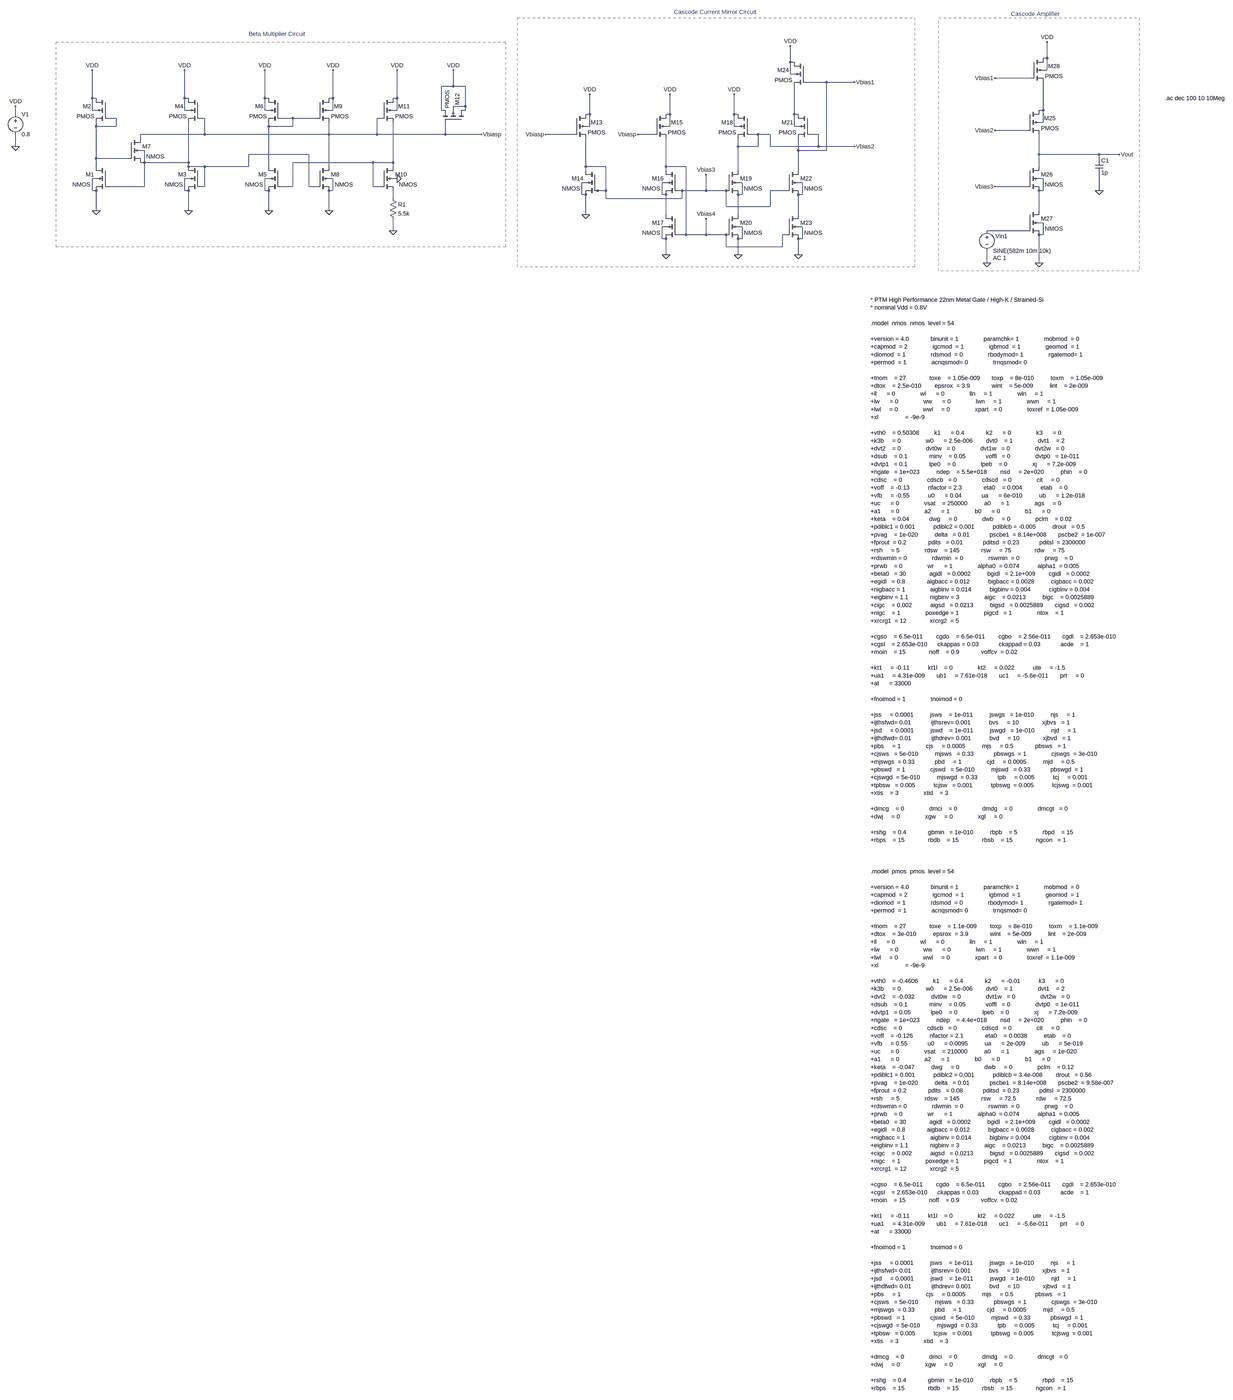
[diagram p0: schematic Rohan Nijhawan_22nm.asc, whole sheet]
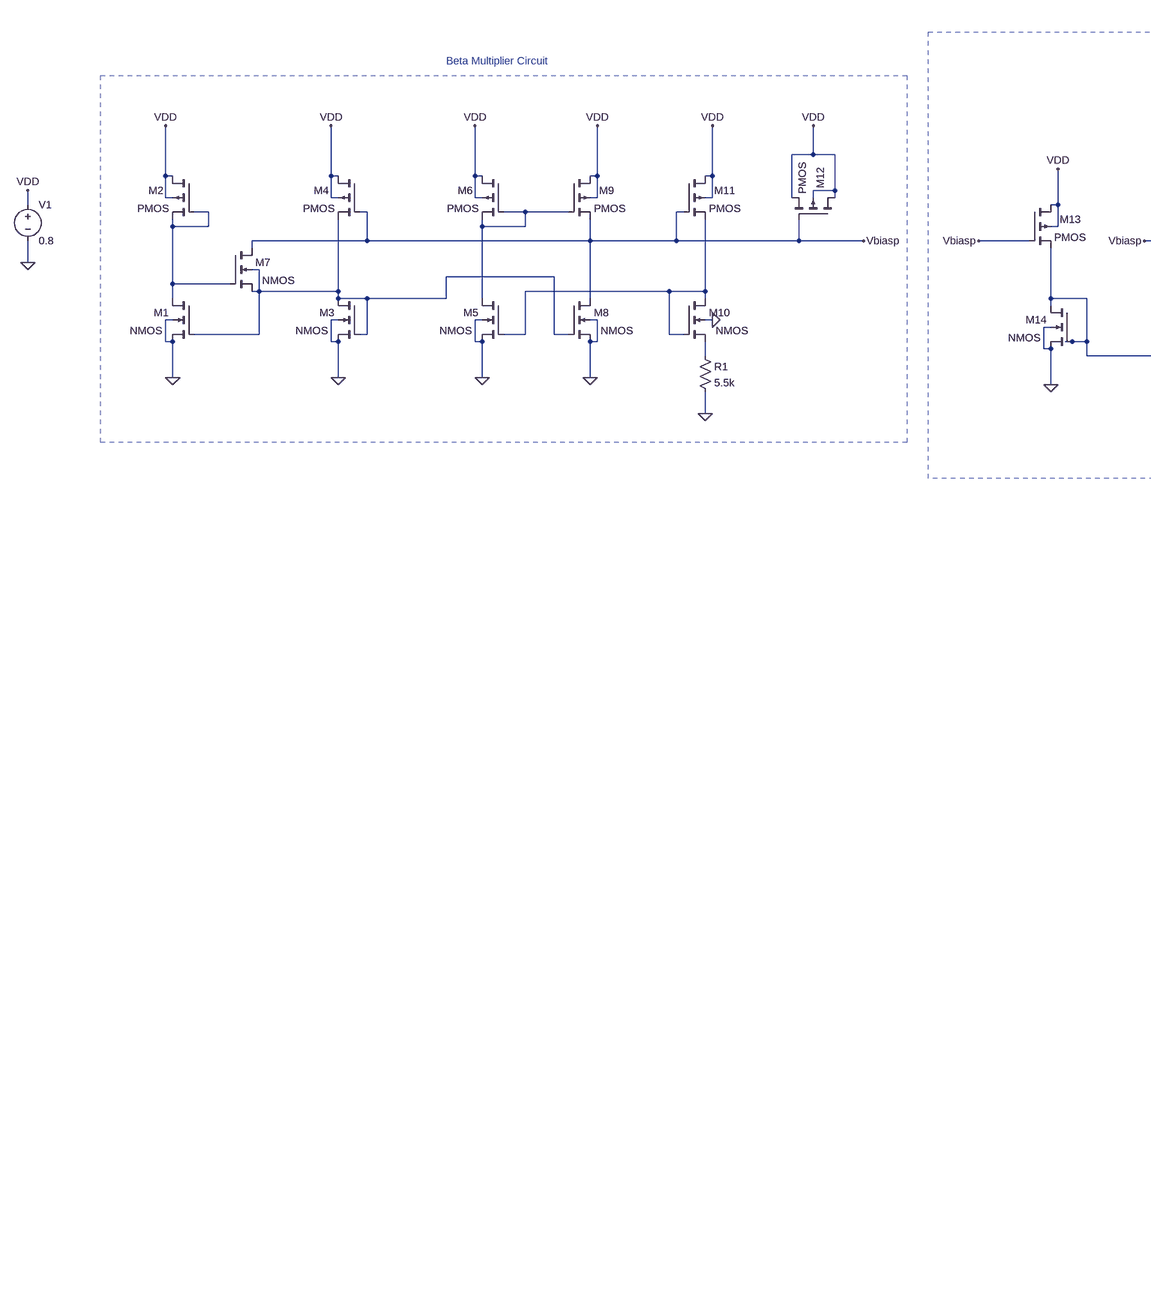
[diagram p1: schematic Rohan Nijhawan_22nm.asc, part, row 1 of 2, column 1 of 2]
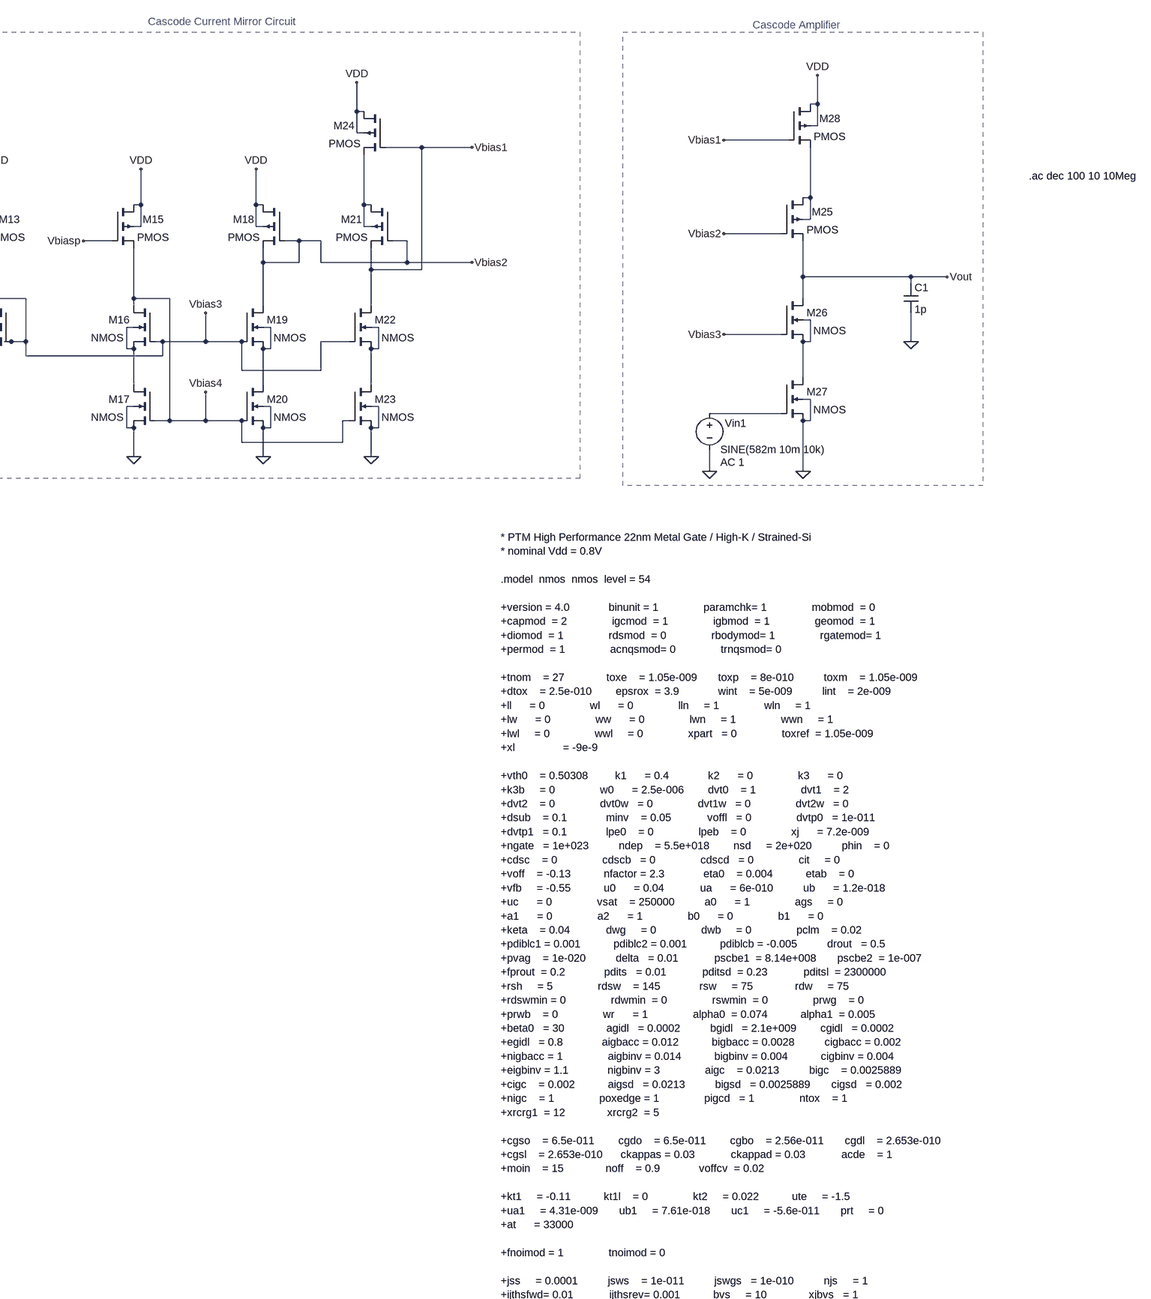
[diagram p2: schematic Rohan Nijhawan_22nm.asc, part, row 1 of 2, column 2 of 2]
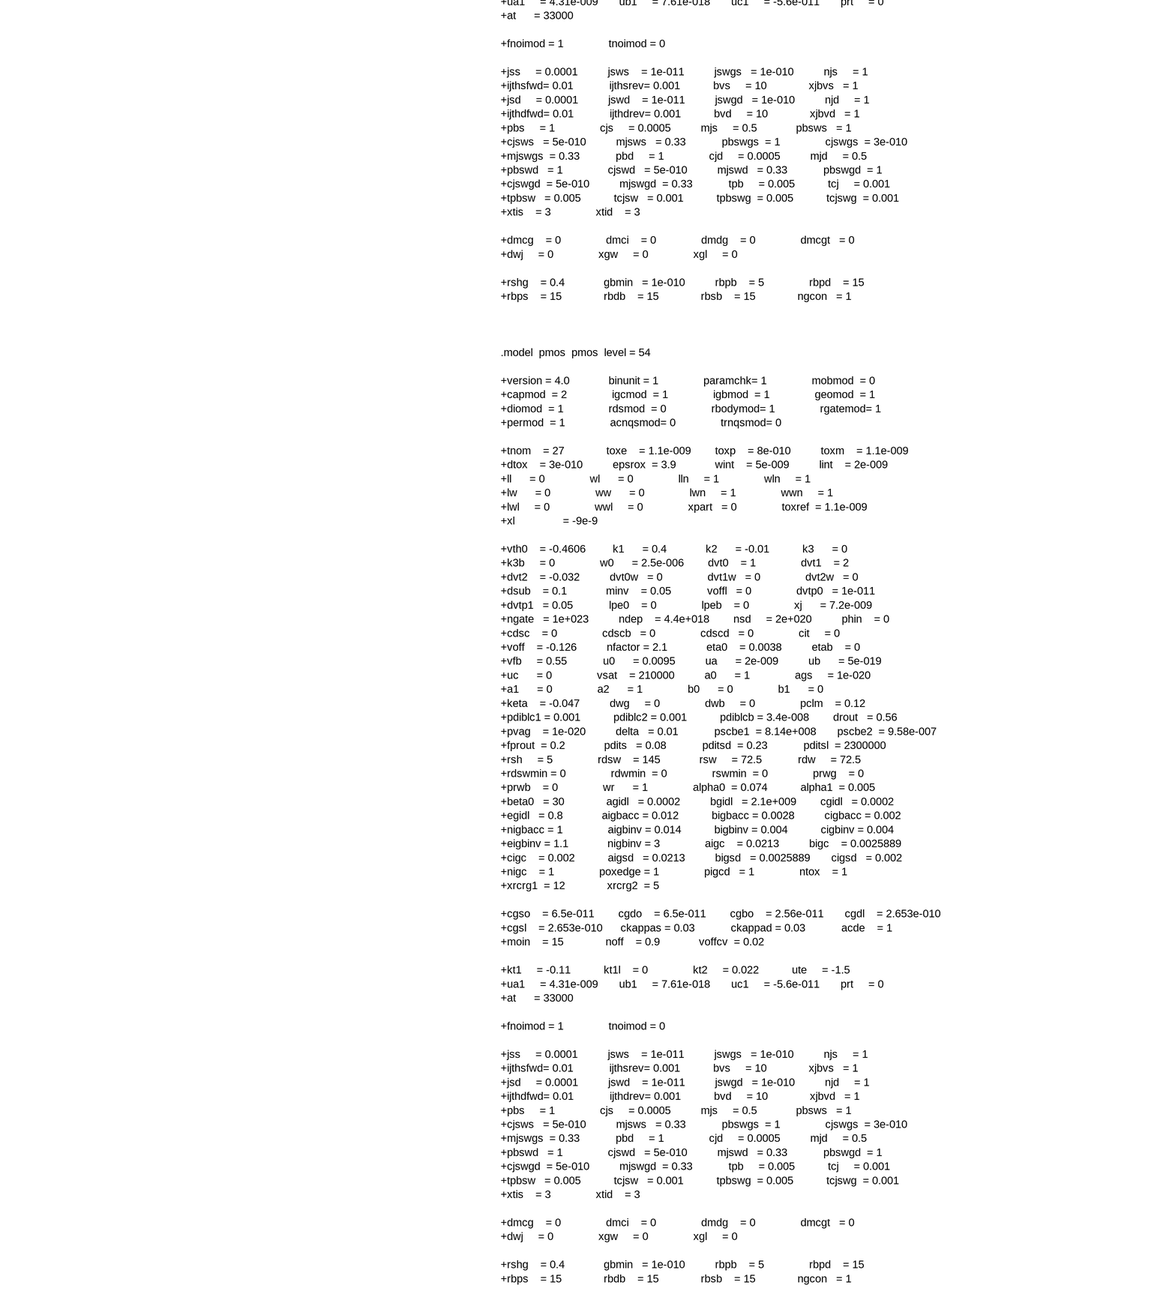
[diagram p3: schematic Rohan Nijhawan_22nm.asc, part, row 2 of 2, column 2 of 2]
Rohan Nijhawan_22nm.asc, the LTspice schematic file:
Version 4
SHEET 1 2824 4712
WIRE 2000 -144 2000 -208
WIRE 2000 -144 1984 -144
WIRE 976 -128 976 -192
WIRE 992 -128 976 -128
WIRE 2000 -96 2000 -144
WIRE 2000 -96 1984 -96
WIRE 976 -80 976 -128
WIRE 992 -80 976 -80
WIRE 1936 -64 1792 -64
WIRE 1120 -48 1040 -48
WIRE 1232 -48 1120 -48
WIRE -368 -32 -368 -96
WIRE -368 -32 -416 -32
WIRE -320 -32 -368 -32
WIRE -1808 16 -1808 -96
WIRE -1792 16 -1808 16
WIRE -1440 16 -1440 -96
WIRE -1424 16 -1440 16
WIRE -1120 16 -1120 -96
WIRE -1104 16 -1120 16
WIRE -848 16 -848 -96
WIRE -848 16 -864 16
WIRE -592 16 -592 -96
WIRE -592 16 -608 16
WIRE -320 48 -320 -32
WIRE -320 48 -368 48
WIRE -1808 64 -1808 16
WIRE -1792 64 -1808 64
WIRE -1440 64 -1440 16
WIRE -1424 64 -1440 64
WIRE -1120 64 -1120 16
WIRE -1104 64 -1120 64
WIRE -848 64 -848 16
WIRE -848 64 -864 64
WIRE -592 64 -592 16
WIRE -592 64 -608 64
WIRE -416 64 -416 -32
WIRE -368 64 -368 48
WIRE -320 64 -320 48
WIRE 1984 64 1984 -48
WIRE 1984 64 1968 64
WIRE -2224 80 -2224 48
WIRE 176 80 176 0
WIRE 176 80 160 80
WIRE 496 80 496 0
WIRE 496 80 480 80
WIRE 752 80 752 0
WIRE 768 80 752 80
WIRE 992 80 992 -32
WIRE 1008 80 992 80
WIRE -1712 96 -1744 96
WIRE -1360 96 -1376 96
WIRE -1008 96 -1056 96
WIRE -912 96 -1008 96
WIRE -656 96 -672 96
WIRE 1984 112 1984 64
WIRE 1984 112 1968 112
WIRE -1792 128 -1792 112
WIRE -1712 128 -1712 96
WIRE -1712 128 -1792 128
WIRE -1104 128 -1104 112
WIRE -1008 128 -1008 96
WIRE -1008 128 -1104 128
WIRE 176 128 176 80
WIRE 176 128 160 128
WIRE 496 128 496 80
WIRE 496 128 480 128
WIRE 752 128 752 80
WIRE 768 128 752 128
WIRE 992 128 992 80
WIRE 1008 128 992 128
WIRE 1920 144 1792 144
WIRE -1360 160 -1360 96
WIRE -1360 160 -1616 160
WIRE -864 160 -864 112
WIRE -864 160 -1360 160
WIRE -672 160 -672 96
WIRE -672 160 -864 160
WIRE -400 160 -400 112
WIRE -400 160 -672 160
WIRE -256 160 -400 160
WIRE 112 160 0 160
WIRE 432 160 368 160
WIRE 848 160 816 160
WIRE 896 160 848 160
WIRE 1088 160 1056 160
WIRE -1616 176 -1616 160
WIRE -2224 208 -2224 160
WIRE 768 208 768 176
WIRE 848 208 848 160
WIRE 848 208 768 208
WIRE 896 208 896 160
WIRE 1088 208 1088 160
WIRE 1088 208 896 208
WIRE 1232 208 1088 208
WIRE -1600 224 -1616 224
WIRE 1008 224 1008 176
WIRE 1120 224 1120 -48
WIRE 1120 224 1008 224
WIRE -944 240 -1184 240
WIRE 1968 240 1968 160
WIRE 2208 240 1968 240
WIRE 2288 240 2208 240
WIRE -1792 256 -1792 128
WIRE -1664 256 -1792 256
WIRE 2208 256 2208 240
WIRE -1600 272 -1600 224
WIRE -1600 272 -1616 272
WIRE -1424 272 -1424 112
WIRE -1424 272 -1600 272
WIRE -688 272 -1008 272
WIRE -608 272 -608 112
WIRE -608 272 -688 272
WIRE -1792 288 -1792 256
WIRE -1424 288 -1424 272
WIRE -1360 288 -1424 288
WIRE -1184 288 -1184 240
WIRE -1184 288 -1360 288
WIRE -1104 288 -1104 128
WIRE -864 288 -864 160
WIRE -608 288 -608 272
WIRE 160 288 160 176
WIRE 240 288 160 288
WIRE 480 288 480 176
WIRE 560 288 480 288
WIRE 1968 288 1968 240
WIRE 160 304 160 288
WIRE 480 304 480 288
WIRE 768 304 768 208
WIRE 1008 304 1008 224
WIRE -1792 336 -1808 336
WIRE -1424 336 -1440 336
WIRE -1104 336 -1120 336
WIRE -848 336 -864 336
WIRE -592 336 -608 336
WIRE 1984 336 1968 336
WIRE 160 352 144 352
WIRE 480 352 464 352
WIRE 784 352 768 352
WIRE 1024 352 1008 352
WIRE -1600 368 -1600 272
WIRE -1600 368 -1744 368
WIRE -1360 368 -1360 288
WIRE -1360 368 -1376 368
WIRE -1008 368 -1008 272
WIRE -1008 368 -1056 368
WIRE -944 368 -944 240
WIRE -912 368 -944 368
WIRE -688 368 -688 272
WIRE -656 368 -688 368
WIRE 1920 368 1792 368
WIRE -1808 384 -1808 336
WIRE -1792 384 -1808 384
WIRE -1440 384 -1440 336
WIRE -1424 384 -1440 384
WIRE -1120 384 -1120 336
WIRE -1104 384 -1120 384
WIRE -848 384 -848 336
WIRE -848 384 -864 384
WIRE 208 384 192 384
WIRE 240 384 240 288
WIRE 240 384 208 384
WIRE 544 384 528 384
WIRE 640 384 640 320
WIRE 640 384 544 384
WIRE 720 384 640 384
WIRE 960 384 896 384
WIRE 1984 384 1984 336
WIRE 1984 384 1968 384
WIRE 2208 384 2208 320
WIRE 144 400 144 352
WIRE 160 400 144 400
WIRE 464 400 464 352
WIRE 480 400 464 400
WIRE 784 400 784 352
WIRE 784 400 768 400
WIRE 1024 400 1024 352
WIRE 1024 400 1008 400
WIRE -608 416 -608 384
WIRE 240 416 240 384
WIRE 544 416 544 384
WIRE 544 416 240 416
WIRE 720 448 720 384
WIRE 896 448 896 384
WIRE 896 448 720 448
WIRE -1792 464 -1792 384
WIRE -1424 464 -1424 384
WIRE -1104 464 -1104 384
WIRE -864 464 -864 384
WIRE 1968 464 1968 384
WIRE 160 480 160 400
WIRE 480 480 480 400
WIRE 768 480 768 400
WIRE 1008 480 1008 400
WIRE 1984 512 1968 512
WIRE 480 528 464 528
WIRE 784 528 768 528
WIRE 1024 528 1008 528
WIRE -608 544 -608 496
WIRE 1920 544 1760 544
WIRE 560 560 560 288
WIRE 560 560 528 560
WIRE 640 560 640 496
WIRE 640 560 560 560
WIRE 720 560 640 560
WIRE 960 560 944 560
WIRE 1984 560 1984 512
WIRE 1984 560 1968 560
WIRE 464 576 464 528
WIRE 480 576 464 576
WIRE 784 576 784 528
WIRE 784 576 768 576
WIRE 1024 576 1024 528
WIRE 1024 576 1008 576
WIRE 720 608 720 560
WIRE 944 608 944 560
WIRE 944 608 720 608
WIRE 480 640 480 576
WIRE 768 640 768 576
WIRE 1008 640 1008 576
WIRE 1760 672 1760 624
WIRE 1968 672 1968 560
FLAG -2224 208 0
FLAG -2224 48 VDD
FLAG -1808 -96 VDD
FLAG -1792 464 0
FLAG -1440 -96 VDD
FLAG -1424 464 0
FLAG -1120 -96 VDD
FLAG -1104 464 0
FLAG -848 -96 VDD
FLAG -864 464 0
FLAG -592 -96 VDD
FLAG -608 544 0
FLAG -368 -96 VDD
FLAG -256 160 Vbiasp
FLAG 0 160 Vbiasp
FLAG 160 480 0
FLAG 176 0 VDD
FLAG 496 0 VDD
FLAG 368 160 Vbiasp
FLAG 480 640 0
FLAG 752 0 VDD
FLAG 768 640 0
FLAG 976 -192 VDD
FLAG 1008 640 0
FLAG 1232 -48 Vbias1
FLAG 1232 208 Vbias2
FLAG 640 320 Vbias3
FLAG 640 496 Vbias4
FLAG 1968 672 0
FLAG 1792 -64 Vbias1
FLAG 1792 144 Vbias2
FLAG 1792 368 Vbias3
FLAG 1760 672 0
FLAG 2208 384 0
FLAG 2288 240 Vout
FLAG 2000 -208 VDD
FLAG -592 336 0
SYMBOL voltage -2224 64 R0
WINDOW 123 0 0 Left 0
WINDOW 39 0 0 Left 0
SYMATTR InstName V1
SYMATTR Value 0.8
SYMBOL nmos4 -1744 288 M0
WINDOW 3 71 72 Left 2
SYMATTR InstName M1
SYMATTR Value2 l=44n w=220n
SYMBOL pmos4 -1744 16 M0
WINDOW 0 68 32 Left 2
SYMATTR InstName M2
SYMATTR Value2 l=440n w=220n
SYMBOL nmos4 -1376 288 M0
WINDOW 3 71 72 Left 2
SYMATTR InstName M3
SYMATTR Value2 l=44n w=220n
SYMBOL pmos4 -1376 16 M0
WINDOW 0 68 32 Left 2
SYMATTR InstName M4
SYMATTR Value2 l=44n w=528n
SYMBOL nmos4 -1056 288 M0
WINDOW 3 71 72 Left 2
SYMATTR InstName M5
SYMATTR Value2 l=44n w=220n
SYMBOL pmos4 -1056 16 M0
WINDOW 0 68 32 Left 2
SYMATTR InstName M6
SYMATTR Value2 l=44n w=528n
SYMBOL nmos4 -1664 176 R0
WINDOW 3 71 72 Left 2
SYMATTR InstName M7
SYMATTR Value2 l=44n w=88n
SYMBOL nmos4 -912 288 R0
WINDOW 3 71 72 Left 2
SYMATTR InstName M8
SYMATTR Value2 l=44n w=220n
SYMBOL pmos4 -912 16 R0
WINDOW 0 68 32 Left 2
SYMATTR InstName M9
SYMATTR Value2 l=44n w=528n
SYMBOL nmos4 -656 288 R0
WINDOW 3 71 72 Left 2
SYMATTR InstName M10
SYMATTR Value2 l=44n w=660n
SYMBOL pmos4 -656 16 R0
WINDOW 0 68 32 Left 2
SYMATTR InstName M11
SYMATTR Value2 l=44n w=528n
SYMBOL res -624 400 R0
SYMATTR InstName R1
SYMATTR Value 5.5k
SYMBOL pmos4 -320 112 M270
WINDOW 0 68 32 Left 2
SYMATTR InstName M12
SYMATTR Value2 l=1100n w=1100n
SYMBOL pmos4 112 80 R0
WINDOW 0 68 32 Left 2
SYMATTR InstName M13
SYMATTR Value2 l=44n w=528n
SYMBOL nmos4 208 304 M0
WINDOW 3 71 72 Left 2
SYMATTR InstName M14
SYMATTR Value2 l=44n w=110n
SYMBOL pmos4 432 80 R0
WINDOW 0 68 32 Left 2
SYMATTR InstName M15
SYMATTR Value2 l=44n w=528n
SYMBOL nmos4 528 304 M0
WINDOW 3 71 72 Left 2
SYMATTR InstName M16
SYMATTR Value2 l=44n w=220n
SYMBOL nmos4 528 480 M0
WINDOW 3 71 72 Left 2
SYMATTR InstName M17
SYMATTR Value2 l=44n w=220n
SYMBOL pmos4 816 80 M0
WINDOW 0 68 32 Left 2
SYMATTR InstName M18
SYMATTR Value2 l=110n w=440n
SYMBOL nmos4 720 304 R0
WINDOW 3 71 72 Left 2
SYMATTR InstName M19
SYMATTR Value2 l=44n w=220n
SYMBOL nmos4 720 480 R0
WINDOW 3 71 72 Left 2
SYMATTR InstName M20
SYMATTR Value2 l=44n w=220n
SYMBOL pmos4 1056 80 M0
WINDOW 0 68 32 Left 2
SYMATTR InstName M21
SYMATTR Value2 l=44n w=528n
SYMBOL nmos4 960 304 R0
WINDOW 3 71 72 Left 2
SYMATTR InstName M22
SYMATTR Value2 l=44n w=220n
SYMBOL nmos4 960 480 R0
WINDOW 3 71 72 Left 2
SYMATTR InstName M23
SYMATTR Value2 l=44n w=220n
SYMBOL pmos4 1040 -128 M0
WINDOW 0 68 32 Left 2
SYMATTR InstName M24
SYMATTR Value2 l=44n w=528n
SYMBOL pmos4 1920 64 R0
WINDOW 0 68 32 Left 2
SYMATTR InstName M25
SYMATTR Value2 l=44n w=550n
SYMBOL nmos4 1920 288 R0
WINDOW 3 71 72 Left 2
SYMATTR InstName M26
SYMATTR Value2 l=44n w=235n
SYMBOL nmos4 1920 464 R0
WINDOW 3 71 72 Left 2
SYMATTR InstName M27
SYMATTR Value2 l=44n w=215n
SYMBOL pmos4 1936 -144 R0
WINDOW 0 68 32 Left 2
SYMATTR InstName M28
SYMATTR Value2 l=44n w=550n
SYMBOL voltage 1760 528 R0
WINDOW 0 34 38 Left 2
WINDOW 123 24 124 Left 2
WINDOW 39 0 0 Left 0
SYMATTR InstName Vin1
SYMATTR Value2 AC 1
SYMATTR Value SINE(582m 10m 10k)
SYMBOL cap 2192 256 R0
SYMATTR InstName C1
SYMATTR Value 1p
TEXT -1184 -240 Left 2 ;Beta Multiplier Circuit
TEXT 512 -328 Left 2 ;Cascode Current Mirror Circuit
TEXT 1856 -320 Left 2 ;Cascode Amplifier
TEXT 2480 16 Left 2 !.ac dec 100 10 10Meg
TEXT 1296 832 Left 2 !* PTM High Performance 22nm Metal Gate / High-K / Strained-Si\n* nominal Vdd = 0.8V\n \n.model  nmos  nmos  level = 54\n \n+version = 4.0             binunit = 1               paramchk= 1               mobmod  = 0             \n+capmod  = 2               igcmod  = 1               igbmod  = 1               geomod  = 1             \n+diomod  = 1               rdsmod  = 0               rbodymod= 1               rgatemod= 1             \n+permod  = 1               acnqsmod= 0               trnqsmod= 0             \n \n+tnom    = 27              toxe    = 1.05e-009       toxp    = 8e-010          toxm    = 1.05e-009     \n+dtox    = 2.5e-010        epsrox  = 3.9             wint    = 5e-009          lint    = 2e-009        \n+ll      = 0               wl      = 0               lln     = 1               wln     = 1             \n+lw      = 0               ww      = 0               lwn     = 1               wwn     = 1             \n+lwl     = 0               wwl     = 0               xpart   = 0               toxref  = 1.05e-009     \n+xl                = -9e-9\n \n+vth0    = 0.50308         k1      = 0.4             k2      = 0               k3      = 0             \n+k3b     = 0               w0      = 2.5e-006        dvt0    = 1               dvt1    = 2             \n+dvt2    = 0               dvt0w   = 0               dvt1w   = 0               dvt2w   = 0             \n+dsub    = 0.1             minv    = 0.05            voffl   = 0               dvtp0   = 1e-011        \n+dvtp1   = 0.1             lpe0    = 0               lpeb    = 0               xj      = 7.2e-009      \n+ngate   = 1e+023          ndep    = 5.5e+018        nsd     = 2e+020          phin    = 0             \n+cdsc    = 0               cdscb   = 0               cdscd   = 0               cit     = 0             \n+voff    = -0.13           nfactor = 2.3             eta0    = 0.004           etab    = 0             \n+vfb     = -0.55           u0      = 0.04            ua      = 6e-010          ub      = 1.2e-018      \n+uc      = 0               vsat    = 250000          a0      = 1               ags     = 0             \n+a1      = 0               a2      = 1               b0      = 0               b1      = 0             \n+keta    = 0.04            dwg     = 0               dwb     = 0               pclm    = 0.02          \n+pdiblc1 = 0.001           pdiblc2 = 0.001           pdiblcb = -0.005          drout   = 0.5           \n+pvag    = 1e-020          delta   = 0.01            pscbe1  = 8.14e+008       pscbe2  = 1e-007        \n+fprout  = 0.2             pdits   = 0.01            pditsd  = 0.23            pditsl  = 2300000       \n+rsh     = 5               rdsw    = 145             rsw     = 75              rdw     = 75            \n+rdswmin = 0               rdwmin  = 0               rswmin  = 0               prwg    = 0             \n+prwb    = 0               wr      = 1               alpha0  = 0.074           alpha1  = 0.005         \n+beta0   = 30              agidl   = 0.0002          bgidl   = 2.1e+009        cgidl   = 0.0002        \n+egidl   = 0.8             aigbacc = 0.012           bigbacc = 0.0028          cigbacc = 0.002         \n+nigbacc = 1               aigbinv = 0.014           bigbinv = 0.004           cigbinv = 0.004         \n+eigbinv = 1.1             nigbinv = 3               aigc    = 0.0213          bigc    = 0.0025889     \n+cigc    = 0.002           aigsd   = 0.0213          bigsd   = 0.0025889       cigsd   = 0.002         \n+nigc    = 1               poxedge = 1               pigcd   = 1               ntox    = 1             \n+xrcrg1  = 12              xrcrg2  = 5             \n \n+cgso    = 6.5e-011        cgdo    = 6.5e-011        cgbo    = 2.56e-011       cgdl    = 2.653e-010    \n+cgsl    = 2.653e-010      ckappas = 0.03            ckappad = 0.03            acde    = 1             \n+moin    = 15              noff    = 0.9             voffcv  = 0.02          \n \n+kt1     = -0.11           kt1l    = 0               kt2     = 0.022           ute     = -1.5          \n+ua1     = 4.31e-009       ub1     = 7.61e-018       uc1     = -5.6e-011       prt     = 0             \n+at      = 33000         \n \n+fnoimod = 1               tnoimod = 0             \n \n+jss     = 0.0001          jsws    = 1e-011          jswgs   = 1e-010          njs     = 1             \n+ijthsfwd= 0.01            ijthsrev= 0.001           bvs     = 10              xjbvs   = 1             \n+jsd     = 0.0001          jswd    = 1e-011          jswgd   = 1e-010          njd     = 1             \n+ijthdfwd= 0.01            ijthdrev= 0.001           bvd     = 10              xjbvd   = 1             \n+pbs     = 1               cjs     = 0.0005          mjs     = 0.5             pbsws   = 1             \n+cjsws   = 5e-010          mjsws   = 0.33            pbswgs  = 1               cjswgs  = 3e-010        \n+mjswgs  = 0.33            pbd     = 1               cjd     = 0.0005          mjd     = 0.5           \n+pbswd   = 1               cjswd   = 5e-010          mjswd   = 0.33            pbswgd  = 1             \n+cjswgd  = 5e-010          mjswgd  = 0.33            tpb     = 0.005           tcj     = 0.001         \n+tpbsw   = 0.005           tcjsw   = 0.001           tpbswg  = 0.005           tcjswg  = 0.001         \n+xtis    = 3               xtid    = 3             \n \n+dmcg    = 0               dmci    = 0               dmdg    = 0               dmcgt   = 0             \n+dwj     = 0               xgw     = 0               xgl     = 0             \n \n+rshg    = 0.4             gbmin   = 1e-010          rbpb    = 5               rbpd    = 15            \n+rbps    = 15              rbdb    = 15              rbsb    = 15              ngcon   = 1             \n \n\n \n.model  pmos  pmos  level = 54\n \n+version = 4.0             binunit = 1               paramchk= 1               mobmod  = 0             \n+capmod  = 2               igcmod  = 1               igbmod  = 1               geomod  = 1             \n+diomod  = 1               rdsmod  = 0               rbodymod= 1               rgatemod= 1             \n+permod  = 1               acnqsmod= 0               trnqsmod= 0             \n \n+tnom    = 27              toxe    = 1.1e-009        toxp    = 8e-010          toxm    = 1.1e-009      \n+dtox    = 3e-010          epsrox  = 3.9             wint    = 5e-009          lint    = 2e-009        \n+ll      = 0               wl      = 0               lln     = 1               wln     = 1             \n+lw      = 0               ww      = 0               lwn     = 1               wwn     = 1             \n+lwl     = 0               wwl     = 0               xpart   = 0               toxref  = 1.1e-009      \n+xl                = -9e-9\n \n+vth0    = -0.4606         k1      = 0.4             k2      = -0.01           k3      = 0             \n+k3b     = 0               w0      = 2.5e-006        dvt0    = 1               dvt1    = 2             \n+dvt2    = -0.032          dvt0w   = 0               dvt1w   = 0               dvt2w   = 0             \n+dsub    = 0.1             minv    = 0.05            voffl   = 0               dvtp0   = 1e-011        \n+dvtp1   = 0.05            lpe0    = 0               lpeb    = 0               xj      = 7.2e-009      \n+ngate   = 1e+023          ndep    = 4.4e+018        nsd     = 2e+020          phin    = 0             \n+cdsc    = 0               cdscb   = 0               cdscd   = 0               cit     = 0             \n+voff    = -0.126          nfactor = 2.1             eta0    = 0.0038          etab    = 0             \n+vfb     = 0.55            u0      = 0.0095          ua      = 2e-009          ub      = 5e-019        \n+uc      = 0               vsat    = 210000          a0      = 1               ags     = 1e-020        \n+a1      = 0               a2      = 1               b0      = 0               b1      = 0             \n+keta    = -0.047          dwg     = 0               dwb     = 0               pclm    = 0.12          \n+pdiblc1 = 0.001           pdiblc2 = 0.001           pdiblcb = 3.4e-008        drout   = 0.56          \n+pvag    = 1e-020          delta   = 0.01            pscbe1  = 8.14e+008       pscbe2  = 9.58e-007     \n+fprout  = 0.2             pdits   = 0.08            pditsd  = 0.23            pditsl  = 2300000       \n+rsh     = 5               rdsw    = 145             rsw     = 72.5            rdw     = 72.5          \n+rdswmin = 0               rdwmin  = 0               rswmin  = 0               prwg    = 0             \n+prwb    = 0               wr      = 1               alpha0  = 0.074           alpha1  = 0.005         \n+beta0   = 30              agidl   = 0.0002          bgidl   = 2.1e+009        cgidl   = 0.0002        \n+egidl   = 0.8             aigbacc = 0.012           bigbacc = 0.0028          cigbacc = 0.002         \n+nigbacc = 1               aigbinv = 0.014           bigbinv = 0.004           cigbinv = 0.004         \n+eigbinv = 1.1             nigbinv = 3               aigc    = 0.0213          bigc    = 0.0025889     \n+cigc    = 0.002           aigsd   = 0.0213          bigsd   = 0.0025889       cigsd   = 0.002         \n+nigc    = 1               poxedge = 1               pigcd   = 1               ntox    = 1             \n+xrcrg1  = 12              xrcrg2  = 5             \n \n+cgso    = 6.5e-011        cgdo    = 6.5e-011        cgbo    = 2.56e-011       cgdl    = 2.653e-010    \n+cgsl    = 2.653e-010      ckappas = 0.03            ckappad = 0.03            acde    = 1             \n+moin    = 15              noff    = 0.9             voffcv  = 0.02          \n \n+kt1     = -0.11           kt1l    = 0               kt2     = 0.022           ute     = -1.5          \n+ua1     = 4.31e-009       ub1     = 7.61e-018       uc1     = -5.6e-011       prt     = 0             \n+at      = 33000         \n \n+fnoimod = 1               tnoimod = 0             \n \n+jss     = 0.0001          jsws    = 1e-011          jswgs   = 1e-010          njs     = 1             \n+ijthsfwd= 0.01            ijthsrev= 0.001           bvs     = 10              xjbvs   = 1             \n+jsd     = 0.0001          jswd    = 1e-011          jswgd   = 1e-010          njd     = 1             \n+ijthdfwd= 0.01            ijthdrev= 0.001           bvd     = 10              xjbvd   = 1             \n+pbs     = 1               cjs     = 0.0005          mjs     = 0.5             pbsws   = 1             \n+cjsws   = 5e-010          mjsws   = 0.33            pbswgs  = 1               cjswgs  = 3e-010        \n+mjswgs  = 0.33            pbd     = 1               cjd     = 0.0005          mjd     = 0.5           \n+pbswd   = 1               cjswd   = 5e-010          mjswd   = 0.33            pbswgd  = 1             \n+cjswgd  = 5e-010          mjswgd  = 0.33            tpb     = 0.005           tcj     = 0.001         \n+tpbsw   = 0.005           tcjsw   = 0.001           tpbswg  = 0.005           tcjswg  = 0.001         \n+xtis    = 3               xtid    = 3             \n \n+dmcg    = 0               dmci    = 0               dmdg    = 0               dmcgt   = 0             \n+dwj     = 0               xgw     = 0               xgl     = 0             \n \n+rshg    = 0.4             gbmin   = 1e-010          rbpb    = 5               rbpd    = 15            \n+rbps    = 15              rbdb    = 15              rbsb    = 15              ngcon   = 1
RECTANGLE Normal -160 608 -1952 -208 2
RECTANGLE Normal 1472 688 -112 -304 2
RECTANGLE Normal 2368 704 1568 -304 2

The netlist it stands for:
* Rohan Nijhawan_22nm.asc
V1 VDD 0 0.8
M1 N003 N005 0 0 NMOS l=44n w=220n
M2 VDD N003 N003 VDD PMOS l=440n w=220n
M3 N005 N005 0 0 NMOS l=44n w=220n
M4 VDD Vbiasp N005 VDD PMOS l=44n w=528n
M5 N004 N006 0 0 NMOS l=44n w=220n
M6 VDD N004 N004 VDD PMOS l=44n w=528n
M7 Vbiasp N003 N005 N005 NMOS l=44n w=88n
M8 Vbiasp N005 0 0 NMOS l=44n w=220n
M9 VDD N004 Vbiasp VDD PMOS l=44n w=528n
M10 N006 N006 N011 0 NMOS l=44n w=660n
M11 VDD Vbiasp N006 VDD PMOS l=44n w=528n
R1 N011 0 5.5k
M12 VDD Vbiasp VDD VDD PMOS l=1100n w=1100n
M13 VDD Vbiasp Vbias3 VDD PMOS l=44n w=528n
M14 Vbias3 Vbias3 0 0 NMOS l=44n w=110n
M15 VDD Vbiasp Vbias4 VDD PMOS l=44n w=528n
M16 Vbias4 Vbias3 N008 N008 NMOS l=44n w=220n
M17 N008 Vbias4 0 0 NMOS l=44n w=220n
M18 VDD Vbias2 Vbias2 VDD PMOS l=110n w=440n
M19 Vbias2 Vbias3 N009 N009 NMOS l=44n w=220n
M20 N009 Vbias4 0 0 NMOS l=44n w=220n
M21 N002 Vbias2 Vbias1 N002 PMOS l=44n w=528n
M22 Vbias1 Vbias3 N010 N010 NMOS l=44n w=220n
M23 N010 Vbias4 0 0 NMOS l=44n w=220n
M24 VDD Vbias1 N002 VDD PMOS l=44n w=528n
M25 N001 Vbias2 Vout N001 PMOS l=44n w=550n
M26 Vout Vbias3 N007 N007 NMOS l=44n w=235n
M27 N007 N012 0 0 NMOS l=44n w=215n
M28 VDD Vbias1 N001 VDD PMOS l=44n w=550n
Vin1 N012 0 SINE(582m 10m 10k) AC 1
C1 Vout 0 1p
.model NMOS NMOS
.model PMOS PMOS
.lib standard.mos
* Beta Multiplier Circuit
* Cascode Current Mirror Circuit
* Cascode Amplifier
.ac dec 100 10 10Meg
* PTM High Performance 22nm Metal Gate / High-K / Strained-Si
* nominal Vdd = 0.8V
.model  nmos  nmos  level = 54
+version = 4.0             binunit = 1               paramchk= 1               mobmod  = 0
+capmod  = 2               igcmod  = 1               igbmod  = 1               geomod  = 1
+diomod  = 1               rdsmod  = 0               rbodymod= 1               rgatemod= 1
+permod  = 1               acnqsmod= 0               trnqsmod= 0
+tnom    = 27              toxe    = 1.05e-009       toxp    = 8e-010          toxm    = 1.05e-009
+dtox    = 2.5e-010        epsrox  = 3.9             wint    = 5e-009          lint    = 2e-009
+ll      = 0               wl      = 0               lln     = 1               wln     = 1
+lw      = 0               ww      = 0               lwn     = 1               wwn     = 1
+lwl     = 0               wwl     = 0               xpart   = 0               toxref  = 1.05e-009
+xl                = -9e-9
+vth0    = 0.50308         k1      = 0.4             k2      = 0               k3      = 0
+k3b     = 0               w0      = 2.5e-006        dvt0    = 1               dvt1    = 2
+dvt2    = 0               dvt0w   = 0               dvt1w   = 0               dvt2w   = 0
+dsub    = 0.1             minv    = 0.05            voffl   = 0               dvtp0   = 1e-011
+dvtp1   = 0.1             lpe0    = 0               lpeb    = 0               xj      = 7.2e-009
+ngate   = 1e+023          ndep    = 5.5e+018        nsd     = 2e+020          phin    = 0
+cdsc    = 0               cdscb   = 0               cdscd   = 0               cit     = 0
+voff    = -0.13           nfactor = 2.3             eta0    = 0.004           etab    = 0
+vfb     = -0.55           u0      = 0.04            ua      = 6e-010          ub      = 1.2e-018
+uc      = 0               vsat    = 250000          a0      = 1               ags     = 0
+a1      = 0               a2      = 1               b0      = 0               b1      = 0
+keta    = 0.04            dwg     = 0               dwb     = 0               pclm    = 0.02
+pdiblc1 = 0.001           pdiblc2 = 0.001           pdiblcb = -0.005          drout   = 0.5
+pvag    = 1e-020          delta   = 0.01            pscbe1  = 8.14e+008       pscbe2  = 1e-007
+fprout  = 0.2             pdits   = 0.01            pditsd  = 0.23            pditsl  = 2300000
+rsh     = 5               rdsw    = 145             rsw     = 75              rdw     = 75
+rdswmin = 0               rdwmin  = 0               rswmin  = 0               prwg    = 0
+prwb    = 0               wr      = 1               alpha0  = 0.074           alpha1  = 0.005
+beta0   = 30              agidl   = 0.0002          bgidl   = 2.1e+009        cgidl   = 0.0002
+egidl   = 0.8             aigbacc = 0.012           bigbacc = 0.0028          cigbacc = 0.002
+nigbacc = 1               aigbinv = 0.014           bigbinv = 0.004           cigbinv = 0.004
+eigbinv = 1.1             nigbinv = 3               aigc    = 0.0213          bigc    = 0.0025889
+cigc    = 0.002           aigsd   = 0.0213          bigsd   = 0.0025889       cigsd   = 0.002
+nigc    = 1               poxedge = 1               pigcd   = 1               ntox    = 1
+xrcrg1  = 12              xrcrg2  = 5
+cgso    = 6.5e-011        cgdo    = 6.5e-011        cgbo    = 2.56e-011       cgdl    = 2.653e-010
+cgsl    = 2.653e-010      ckappas = 0.03            ckappad = 0.03            acde    = 1
+moin    = 15              noff    = 0.9             voffcv  = 0.02
+kt1     = -0.11           kt1l    = 0               kt2     = 0.022           ute     = -1.5
+ua1     = 4.31e-009       ub1     = 7.61e-018       uc1     = -5.6e-011       prt     = 0
+at      = 33000
+fnoimod = 1               tnoimod = 0
+jss     = 0.0001          jsws    = 1e-011          jswgs   = 1e-010          njs     = 1
+ijthsfwd= 0.01            ijthsrev= 0.001           bvs     = 10              xjbvs   = 1
+jsd     = 0.0001          jswd    = 1e-011          jswgd   = 1e-010          njd     = 1
+ijthdfwd= 0.01            ijthdrev= 0.001           bvd     = 10              xjbvd   = 1
+pbs     = 1               cjs     = 0.0005          mjs     = 0.5             pbsws   = 1
+cjsws   = 5e-010          mjsws   = 0.33            pbswgs  = 1               cjswgs  = 3e-010
+mjswgs  = 0.33            pbd     = 1               cjd     = 0.0005          mjd     = 0.5
+pbswd   = 1               cjswd   = 5e-010          mjswd   = 0.33            pbswgd  = 1
+cjswgd  = 5e-010          mjswgd  = 0.33            tpb     = 0.005           tcj     = 0.001
+tpbsw   = 0.005           tcjsw   = 0.001           tpbswg  = 0.005           tcjswg  = 0.001
+xtis    = 3               xtid    = 3
+dmcg    = 0               dmci    = 0               dmdg    = 0               dmcgt   = 0
+dwj     = 0               xgw     = 0               xgl     = 0
+rshg    = 0.4             gbmin   = 1e-010          rbpb    = 5               rbpd    = 15
+rbps    = 15              rbdb    = 15              rbsb    = 15              ngcon   = 1
.model  pmos  pmos  level = 54
+version = 4.0             binunit = 1               paramchk= 1               mobmod  = 0
+capmod  = 2               igcmod  = 1               igbmod  = 1               geomod  = 1
+diomod  = 1               rdsmod  = 0               rbodymod= 1               rgatemod= 1
+permod  = 1               acnqsmod= 0               trnqsmod= 0
+tnom    = 27              toxe    = 1.1e-009        toxp    = 8e-010          toxm    = 1.1e-009
+dtox    = 3e-010          epsrox  = 3.9             wint    = 5e-009          lint    = 2e-009
+ll      = 0               wl      = 0               lln     = 1               wln     = 1
+lw      = 0               ww      = 0               lwn     = 1               wwn     = 1
+lwl     = 0               wwl     = 0               xpart   = 0               toxref  = 1.1e-009
+xl                = -9e-9
+vth0    = -0.4606         k1      = 0.4             k2      = -0.01           k3      = 0
+k3b     = 0               w0      = 2.5e-006        dvt0    = 1               dvt1    = 2
+dvt2    = -0.032          dvt0w   = 0               dvt1w   = 0               dvt2w   = 0
+dsub    = 0.1             minv    = 0.05            voffl   = 0               dvtp0   = 1e-011
+dvtp1   = 0.05            lpe0    = 0               lpeb    = 0               xj      = 7.2e-009
+ngate   = 1e+023          ndep    = 4.4e+018        nsd     = 2e+020          phin    = 0
+cdsc    = 0               cdscb   = 0               cdscd   = 0               cit     = 0
+voff    = -0.126          nfactor = 2.1             eta0    = 0.0038          etab    = 0
+vfb     = 0.55            u0      = 0.0095          ua      = 2e-009          ub      = 5e-019
+uc      = 0               vsat    = 210000          a0      = 1               ags     = 1e-020
+a1      = 0               a2      = 1               b0      = 0               b1      = 0
+keta    = -0.047          dwg     = 0               dwb     = 0               pclm    = 0.12
+pdiblc1 = 0.001           pdiblc2 = 0.001           pdiblcb = 3.4e-008        drout   = 0.56
+pvag    = 1e-020          delta   = 0.01            pscbe1  = 8.14e+008       pscbe2  = 9.58e-007
+fprout  = 0.2             pdits   = 0.08            pditsd  = 0.23            pditsl  = 2300000
+rsh     = 5               rdsw    = 145             rsw     = 72.5            rdw     = 72.5
+rdswmin = 0               rdwmin  = 0               rswmin  = 0               prwg    = 0
+prwb    = 0               wr      = 1               alpha0  = 0.074           alpha1  = 0.005
+beta0   = 30              agidl   = 0.0002          bgidl   = 2.1e+009        cgidl   = 0.0002
+egidl   = 0.8             aigbacc = 0.012           bigbacc = 0.0028          cigbacc = 0.002
+nigbacc = 1               aigbinv = 0.014           bigbinv = 0.004           cigbinv = 0.004
+eigbinv = 1.1             nigbinv = 3               aigc    = 0.0213          bigc    = 0.0025889
+cigc    = 0.002           aigsd   = 0.0213          bigsd   = 0.0025889       cigsd   = 0.002
+nigc    = 1               poxedge = 1               pigcd   = 1               ntox    = 1
+xrcrg1  = 12              xrcrg2  = 5
+cgso    = 6.5e-011        cgdo    = 6.5e-011        cgbo    = 2.56e-011       cgdl    = 2.653e-010
+cgsl    = 2.653e-010      ckappas = 0.03            ckappad = 0.03            acde    = 1
+moin    = 15              noff    = 0.9             voffcv  = 0.02
+kt1     = -0.11           kt1l    = 0               kt2     = 0.022           ute     = -1.5
+ua1     = 4.31e-009       ub1     = 7.61e-018       uc1     = -5.6e-011       prt     = 0
+at      = 33000
+fnoimod = 1               tnoimod = 0
+jss     = 0.0001          jsws    = 1e-011          jswgs   = 1e-010          njs     = 1
+ijthsfwd= 0.01            ijthsrev= 0.001           bvs     = 10              xjbvs   = 1
+jsd     = 0.0001          jswd    = 1e-011          jswgd   = 1e-010          njd     = 1
+ijthdfwd= 0.01            ijthdrev= 0.001           bvd     = 10              xjbvd   = 1
+pbs     = 1               cjs     = 0.0005          mjs     = 0.5             pbsws   = 1
+cjsws   = 5e-010          mjsws   = 0.33            pbswgs  = 1               cjswgs  = 3e-010
+mjswgs  = 0.33            pbd     = 1               cjd     = 0.0005          mjd     = 0.5
+pbswd   = 1               cjswd   = 5e-010          mjswd   = 0.33            pbswgd  = 1
+cjswgd  = 5e-010          mjswgd  = 0.33            tpb     = 0.005           tcj     = 0.001
+tpbsw   = 0.005           tcjsw   = 0.001           tpbswg  = 0.005           tcjswg  = 0.001
+xtis    = 3               xtid    = 3
+dmcg    = 0               dmci    = 0               dmdg    = 0               dmcgt   = 0
+dwj     = 0               xgw     = 0               xgl     = 0
+rshg    = 0.4             gbmin   = 1e-010          rbpb    = 5               rbpd    = 15
+rbps    = 15              rbdb    = 15              rbsb    = 15              ngcon   = 1
.backanno
.end